# EAGLE design Board V.1C (EAGLE 7.2.0)
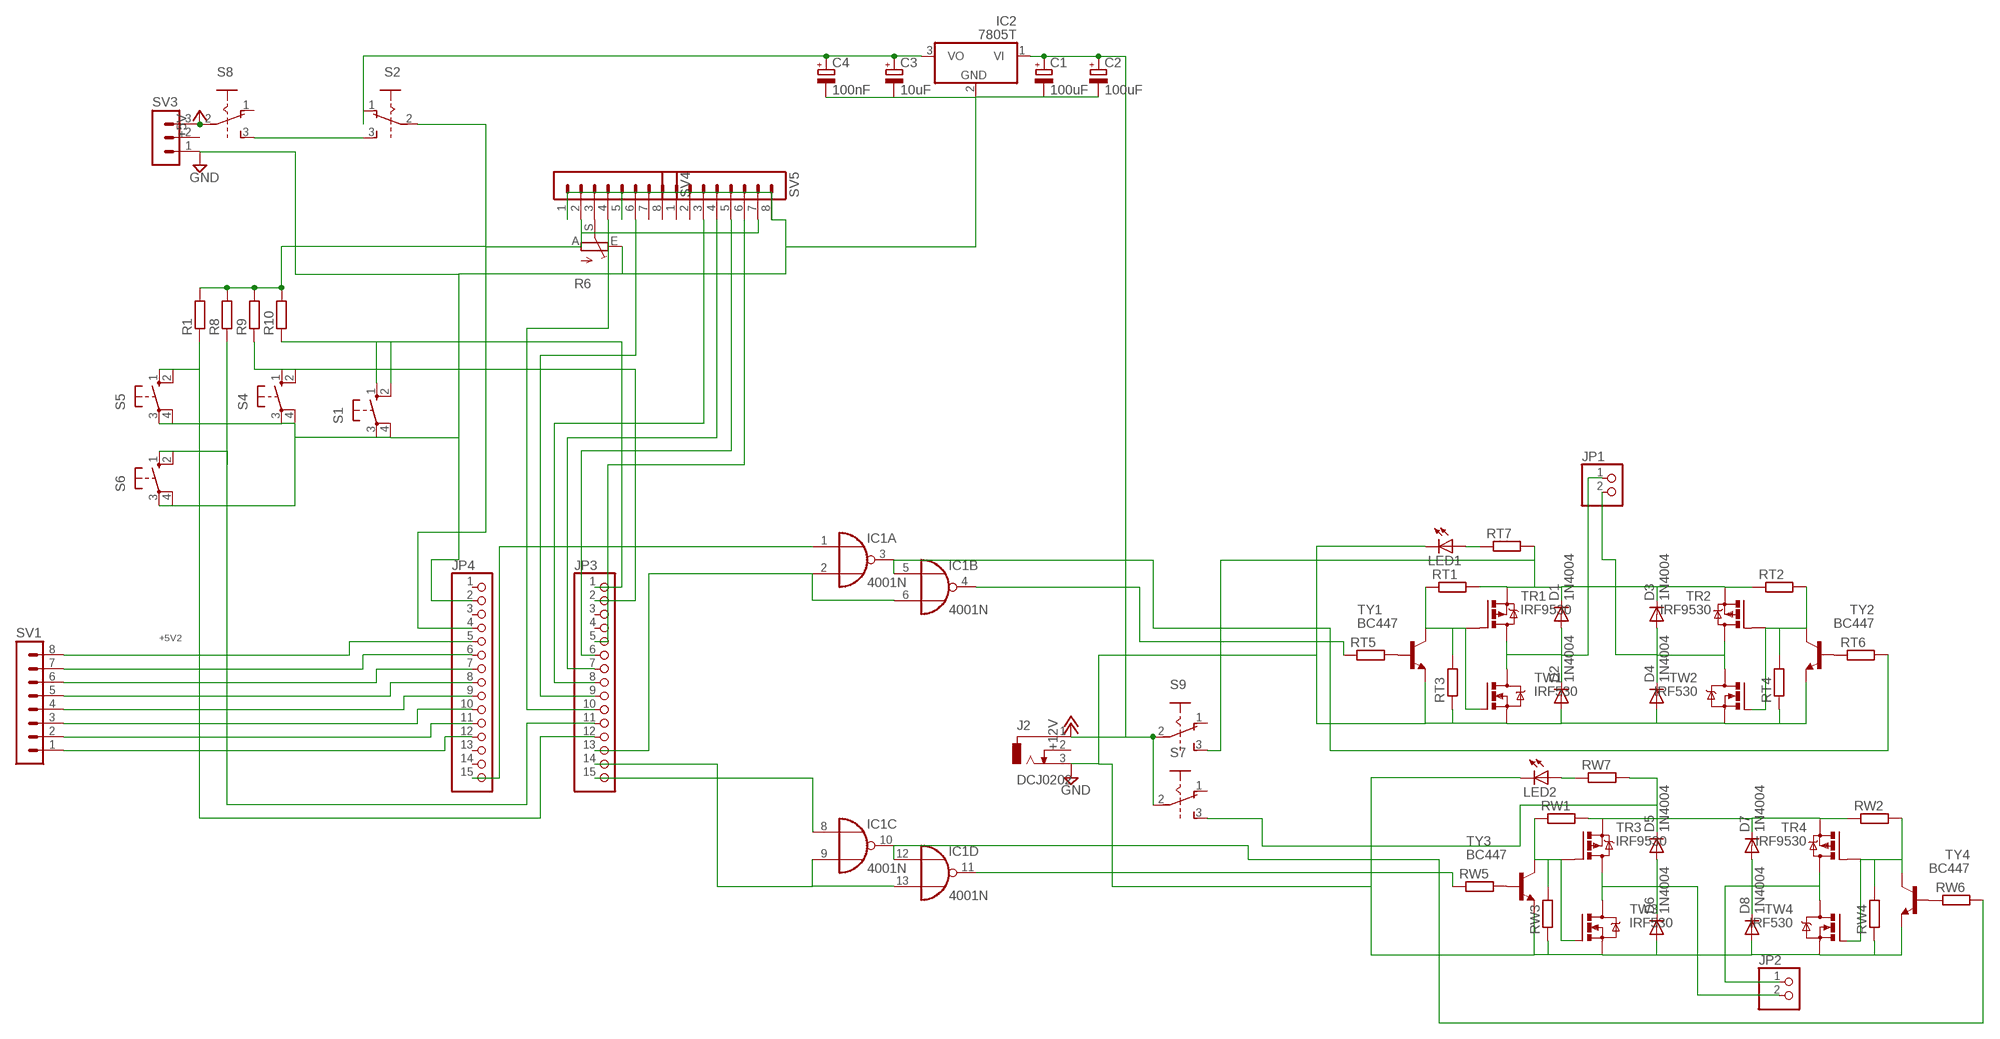
[diagram p0: schematic, sheet 1]

## Parts
C1  100uF  CPOL-EUE2.5-6  [E2,5-6]
C2  100uF  CPOL-EUE2.5-6  [E2,5-6]
C3  10uF  CPOL-EUE2.5-6  [E2,5-6]
C4  100nF  CPOL-EUE2.5-6  [E2,5-6]
D1  1N4004  [DO41-10]
D2  1N4004  [DO41-10]
D3  1N4004  [DO41-10]
D4  1N4004  [DO41-10]
D5  1N4004  [DO41-10]
D6  1N4004  [DO41-10]
D7  1N4004  [DO41-10]
D8  1N4004  [DO41-10]
IC1  4001N  [DIL14]
IC2  7805T  [TO220H]
J2  DCJ0202  [DCJ0202]
JP1  PINHD-1X2  [1X02]
JP2  PINHD-1X2  [1X02]
JP3  PINHD-1X15  [1X15]
JP4  PINHD-1X15  [1X15]
LED1  LED5MM  [LED5MM]
LED2  LED5MM  [LED5MM]
R1  R-EU_0204/7  [0204/7]
R6  TRIM_EU-B25P  [B25P]
R8  R-EU_0204/7  [0204/7]
R9  R-EU_0204/7  [0204/7]
R10  R-EU_0204/7  [0204/7]
RT1  R-EU_0207/7  [0207/7]
RT2  R-EU_0207/7  [0207/7]
RT3  R-EU_0207/7  [0207/7]
RT4  R-EU_0207/7  [0207/7]
RT5  R-EU_0207/7  [0207/7]
RT6  R-EU_0207/7  [0207/7]
RT7  R-EU_0207/7  [0207/7]
RW1  R-EU_0207/7  [0207/7]
RW2  R-EU_0207/7  [0207/7]
RW3  R-EU_0207/7  [0207/7]
RW4  R-EU_0207/7  [0207/7]
RW5  R-EU_0207/7  [0207/7]
RW6  R-EU_0207/7  [0207/7]
RW7  R-EU_0207/7  [0207/7]
S1  10-XX  [B3F-10XX]
S2  A68-A31  [A68-A31]
S4  10-XX  [B3F-10XX]
S5  10-XX  [B3F-10XX]
S6  10-XX  [B3F-10XX]
S7  A68-A31  [A68-A31]
S8  A68-A31  [A68-A31]
S9  A68-A31  [A68-A31]
SV1  MA08-1  [MA08-1]
SV3  MA03-1  [MA03-1]
SV4  MA08-1  [MA08-1]
SV5  MA08-1  [MA08-1]
TR1  IRF9530  [TO220BV]
TR2  IRF9530  [TO220BV]
TR3  IRF9530  [TO220BV]
TR4  IRF9530  [TO220BV]
TW1  IRF530  [TO220BV]
TW2  IRF530  [TO220BV]
TW3  IRF530  [TO220BV]
TW4  IRF530  [TO220BV]
TY1  BC447  [TO92-EBC]
TY2  BC447  [TO92-EBC]
TY3  BC447  [TO92-EBC]
TY4  BC447  [TO92-EBC]

## Nets
12V-A: D1.C D3.C RT1.2 RT2.1 RT7.2 S9.3(A:S) TR1.S TR2.S
12V-B: D5.C D7.C RW1.2 RW2.1 RW7.2 S7.3(A:S) TR3.S TR4.S
+5V: S8.2(A:P) SV3.3
+5V2: JP4.4 R1.2 R6.A R8.2 R9.2 R10.2 S2.2(A:P) SV4.2 SV5.7
+12V: C1.+ C2.+ IC2.1(VI) J2.1 S7.2(A:P) S9.2(A:P)
GND: C1.- C2.- C3.- C4.- D2.A D4.A D6.A D8.A IC2.2(GND) J2.3 JP4.2 LED1.K(C) LED2.K(C) R6.E RT3.1 RT4.1 RW3.1 RW4.1 S1.3(P) S1.4(P1) S4.3(P) S4.4(P1) S5.3(P) S5.4(P1) S6.3(P) S6.4(P1) SV3.1 SV4.1 SV4.5 SV5.8 TW1.S TW2.S TW3.S TW4.S TY1.E TY2.E TY3.E TY4.E
N$1: LED1.A RT7.1
N$2: LED2.A RW7.1
N$3: IC1.4(B:O) RT5.1
N$4: IC1.1(A:I0) JP4.15
N$5: S2.3(A:S) S8.3(A:S)
N$7: JP3.1 R10.1 S1.1(S) S1.2(S1)
N$8: C3.+ C4.+ IC2.3(VO)
N$9: RT1.1 RT3.2 TR1.G TW1.G TY1.C
N$10: JP4.8 SV1.5
N$11: JP3.10 SV4.4
N$12: IC1.8(C:I0) JP3.15
N$13: R6.S SV4.3
N$14: JP3.9 SV4.6
N$15: JP4.7 SV1.6
N$16: JP3.8 SV5.3
N$17: RT5.2 TY1.B
N$18: RT6.1 TY2.B
N$19: RT2.2 RT4.2 TR2.G TW2.G TY2.C
N$20: D7.A D8.C JP2.1 TR4.D TW4.D
N$21: D5.A D6.C JP2.2 TR3.D TW3.D
N$22: RW2.2 RW4.2 TR4.G TW4.G TY4.C
N$23: JP4.5 SV1.8
N$24: JP4.6 SV1.7
N$27: JP4.9 SV1.4
N$28: JP3.7 SV5.4
N$29: JP3.6 SV5.5
N$30: JP3.5 SV5.6
N$31: RW1.1 RW3.2 TR3.G TW3.G TY3.C
N$32: JP3.2 R9.1 S4.1(S) S4.2(S1)
N$33: JP3.11 R8.1 S6.1(S) S6.2(S1)
N$34: JP3.12 R1.1 S5.1(S) S5.2(S1)
N$35: RW6.1 TY4.B
N$38: RW5.2 TY3.B
N$40: IC1.2(A:I1) IC1.6(B:I1) JP3.13
N$43: JP4.12 SV1.1
N$45: IC1.9(C:I1) IC1.13(D:I1) JP3.14
N$46: JP4.10 SV1.3
N$47: JP4.11 SV1.2
N$51: D1.A D2.C JP1.1 TR1.D TW1.D
N$52: D3.A D4.C JP1.2 TR2.D TW2.D
N$53: IC1.3(A:O) IC1.5(B:I0) RT6.2
N$54: IC1.10(C:O) IC1.12(D:I0) RW6.2
N$55: IC1.11(D:O) RW5.1
Unconnected: J2.2 JP3.3 JP3.4 JP4.1 JP4.3 JP4.13 JP4.14 S2.1(A:O) S2.4(B:O) S2.5(B:P) S2.6(B:S) S7.1(A:O) S7.4(B:O) S7.5(B:P) S7.6(B:S) S8.1(A:O) S8.4(B:O) S8.5(B:P) S8.6(B:S) S9.1(A:O) S9.4(B:O) S9.5(B:P) S9.6(B:S) SV3.2 SV4.7 SV4.8 SV5.1 SV5.2

## Power pins joined to a net without a drawn wire
+5V: IC1.14(P:VDD)
GND: IC1.7(P:VSS)

## Library data of the parts
C1-C4 = resistor:CPOL-EU: POLARIZED CAPACITOR, European symbol
D1-D8 = diode:1N4004: DIODE general purpose rectifier, 1 A
IC1 = 40xx:4001: Quad 2-input NOR
IC2 = linear:78*: Positive VOLTAGE REGULATOR Source: http://cache.national.com/ds/LM/LM78L05.pdf http://www.fairchildsemi.com/ds/LM/LM7805.pdf
J2 = con-jack:DCJ0202: DC POWER JACK Source: DCJ0202.pdf
JP1 JP2 = pinhead:PINHD-1X2: PIN HEADER
JP3 JP4 = pinhead:PINHD-1X15: PIN HEADER
LED1 LED2 = led:LED: LED OSRAM: - CHIPLED LG R971, LG N971, LY N971, LG Q971, LY Q971, LO R971, LY R971 LH N974, LH R974 LS Q976, LO Q976, LY Q976 LO Q996 - Hyper CHIPLED LW Q18S LB Q993, LB Q99A, LB R99A - SideLED LS A670, LO A670, LY A670, LG A670, LP A670 LB A673, LV A673, LT A673, LW A673 LH A674 LY A675 LS A676, LA A676, LO A676, LY A676, LW A676 LS A679, LY A679, LG A679 - Hyper Micro SIDELED® LS Y876, LA Y876, LO Y876, LY Y876 LT Y87S - SmartLED LW L88C, LW L88S LB L89C, LB L89S, LG L890 LS L89K, LO L89K, LY L89K LS L896, LA L896, LO L896, LY L896 - TOPLED LS T670, LO T670, LY T670, LG T670, LP T670 LSG T670, LSP T670, LSY T670, LOP T670, LYG T670 LG T671, LOG T671, LSG T671 LB T673, LV T673, LT T673, LW T673 LH T674 LS T676, LA T676, LO T676, LY T676, LB T676, LH T676, LSB T676, LW T676 LB T67C, LV T67C, LT T67C, LS T67K, LO T67K, LY T67K, LW E67C LS E67B, LA E67B, LO E67B, LY E67B, LB E67C, LV E67C, LT E67C LW T67C LS T679, LY T679, LG T679 LS T770, LO T770, LY T770, LG T770, LP T770 LB T773, LV T773, LT T773, LW T773 LH T774 LS E675, LA E675, LY E675, LS T675 LS T776, LA T776, LO T776, LY T776, LB T776 LHGB T686 LT T68C, LB T68C - Hyper Mini TOPLED® LB M676 - Mini TOPLED Santana® LG M470 LS M47K, LO M47K, LY M47K Source: http://www.osram.convergy.de LUXEON: - LUMILED® LXK2-PW12-R00, LXK2-PW12-S00, LXK2-PW14-U00, LXK2-PW14-V00 LXK2-PM12-R00, LXK2-PM12-S00, LXK2-PM14-U00 LXK2-PE12-Q00, LXK2-PE12-R00, LXK2-PE12-S00, LXK2-PE14-T00, LXK2-PE14-U00 LXK2-PB12-K00, LXK2-PB12-L00, LXK2-PB12-M00, LXK2-PB14-N00, LXK2-PB14-P00, LXK2-PB14-Q00 LXK2-PR12-L00, LXK2-PR12-M00, LXK2-PR14-Q00, LXK2-PR14-R00 LXK2-PD12-Q00, LXK2-PD12-R00, LXK2-PD12-S00 LXK2-PH12-R00, LXK2-PH12-S00 LXK2-PL12-P00, LXK2-PL12-Q00, LXK2-PL12-R00 Source: www.luxeon.com KINGBRIGHT: KA-3528ASYC Source: www.kingbright.com
R1 R8-R10 RT1-RT7 RW1-RW7 = resistor:R-EU_: RESISTOR, European symbol
R6 = pot:TRIM_EU-: POTENTIOMETER
S1 S4-S6 = switch-omron:10-XX: OMRON SWITCH
S2 S7-S9 = switch:A68-A31: SLIDING SWITCH Siemens, distributor Buerklin, 11G766
SV1 SV4 SV5 = con-lstb:MA08-1: PIN HEADER; OC_FARNELL: unknown; OC_NEWARK: unknown
SV3 = con-lstb:MA03-1: PIN HEADER
TR1-TR4 = transistor-power:IRF9530: P-CHANNEL HEXFET POWER-MOS-FET Source: http://www.irf.com/product-info/datasheets/data/irf9530.pdf
TW1-TW4 = transistor-power:IRF530: HEXFET Power MOSFET
TY1-TY4 = transistor-npn:BC447*: NPN Transistor

## Net classes
0 default: width 0.051 mm, clearance 0.051 mm

## Board
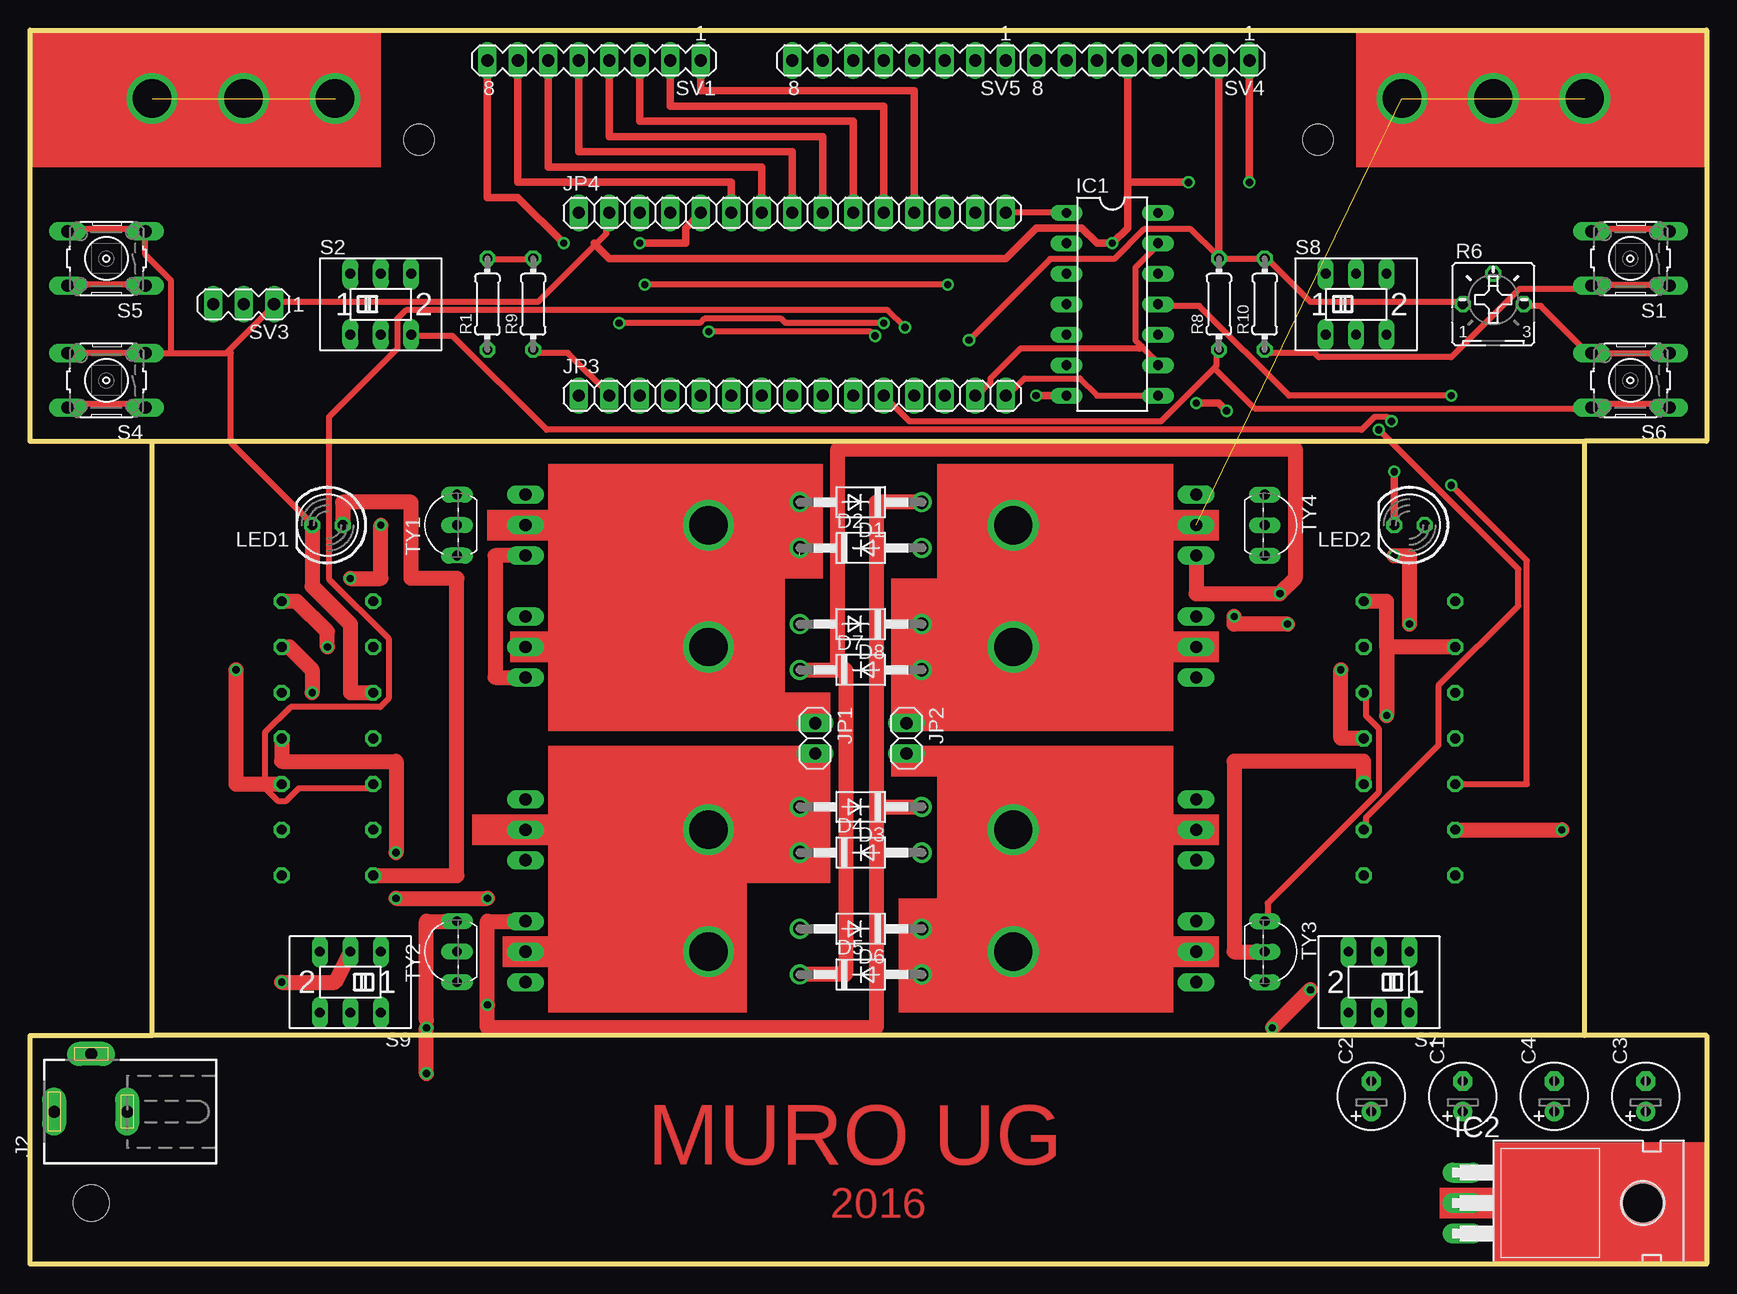
[diagram p1: board, top side]
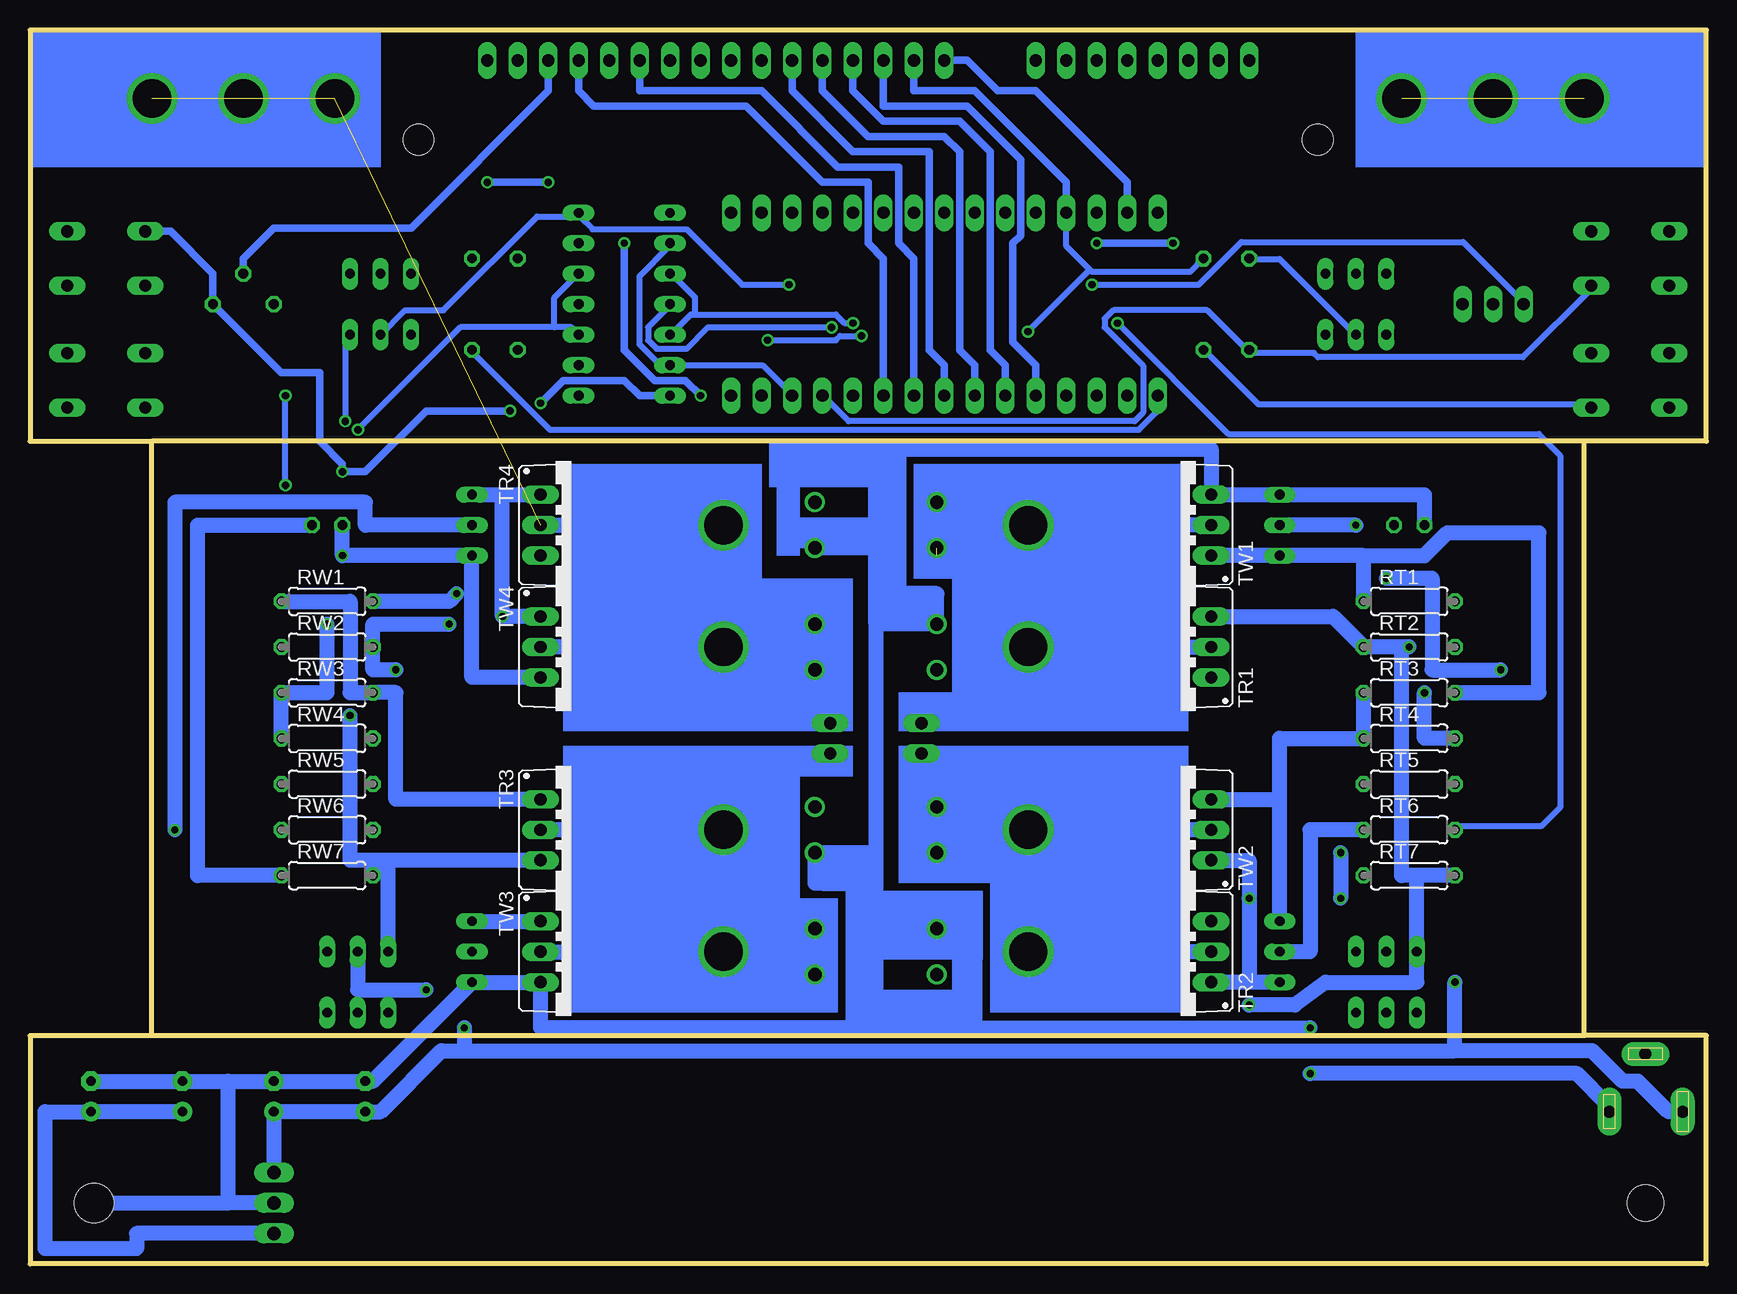
[diagram p2: board, bottom side, seen from below]

Size 139.7 x 102.87 mm. Coordinates in mm from the lower left corner, seen from the top.
Outline: 129.54,19.05 139.7,19.05 139.7,0 0,0 0,19.05 10.16,19.05
Outline: 10.16,19.05 10.16,68.58
Outline: 129.54,19.05 129.54,68.58
Outline: 10.16,68.58 0,68.58 0,102.87 139.7,102.87 139.7,68.58 129.54,68.58
Outline: 10.16,68.58 129.54,68.58
Outline: 129.54,19.05 10.16,19.05
Copper layers (1*16): Top 0.035mm / dielectric 1.5mm / Bottom 0.035mm
Design rules "default *": minimum track width 20mil, minimum drill 24mil, track to track 8mil, track to pad 8mil, pad to pad 8mil, via to via 8mil, smd to smd 8mil, copper to edge 40mil, drill to drill 8mil, minimum pad ring 10mil, minimum via ring 8mil, stop-mask expansion 4mil, vias tented up to drill 0mil, thermal gap 10mil
Holes 3 mm at 5.08,5.08
Holes 2.54 mm at 32.38,93.73 107.31,93.73

### Footprints (pad centres in the part's own frame; a part is rotated, then mirrored left to right if it is on the bottom)
E2,5-6 = drill 0.813 pad 1.6: + -1.27,0 | drill 0.813 pad 1.6 octagon: - 1.27,0
DO41-10 = drill 1.118: A 5.08,0; C -5.08,0
DIL14 = drill 0.813 long: 1 -7.62,-3.81; 2 -5.08,-3.81; 3 -2.54,-3.81; 4 0,-3.81; 5 2.54,-3.81; 6 5.08,-3.81; 7 7.62,-3.81; 8 7.62,3.81; 9 5.08,3.81; 10 2.54,3.81; 11 0,3.81; 12 -2.54,3.81; 13 -5.08,3.81; 14 -7.62,3.81
TO220H = drill 1.118 long: 1 -2.54,-10.16; 2 0,-10.16; 3 2.54,-10.16 | hole 3.302: 0,4.826
DCJ0202 = drill 1 pad 2 long: 1 0,3.1; 2 4.8,0; 3 0,-3
1X02 = drill 1.016 long: 1 -1.27,0; 2 1.27,0
1X15 = drill 1.016 long: 1 -17.78,0; 2 -15.24,0; 3 -12.7,0; 4 -10.16,0; 5 -7.62,0; 6 -5.08,0; 7 -2.54,0; 8 0,0; 9 2.54,0; 10 5.08,0; 11 7.62,0; 12 10.16,0; 13 12.7,0; 14 15.24,0; 15 17.78,0
LED5MM = drill 0.813 octagon: A -1.27,0; K 1.27,0
0204/7 = drill 0.813 octagon: 1 -3.81,0; 2 3.81,0
B25P = drill 0.813 octagon: A -2.54,0; E 2.54,0; S 0,2.54
0207/7 = drill 0.813 octagon: 1 -3.81,0; 2 3.81,0
B3F-10XX = drill 1.016 long: 1 -3.251,2.261; 2 3.251,2.261; 3 -3.251,-2.261; 4 3.251,-2.261
A68-A31 = drill 0.813 long: 1 -2.54,-2.54; 2 0,-2.54; 3 2.54,-2.54; 4 -2.54,2.54; 5 0,2.54; 6 2.54,2.54
MA08-1 = drill 1.016 long: 1 -8.89,0; 2 -6.35,0; 3 -3.81,0; 4 -1.27,0; 5 1.27,0; 6 3.81,0; 7 6.35,0; 8 8.89,0
MA03-1 = drill 1.016 long: 1 -2.54,0; 2 0,0; 3 2.54,0
TO220BV = drill 1.016 long: D 0,-2.54; G -2.54,-2.54; S 2.54,-2.54
TO92-EBC = drill 0.813 long: B 0,-1.27; C -2.54,-1.27; E 2.54,-1.27

### Placement (x,y rotation side)
C1  119.38,13.97 90 top
C2  111.76,13.97 90 top
C3  134.62,13.97 90 top
C4  127,13.97 90 top
D1  69.22,63.5 180 top
D2  69.22,59.69 0 top
D3  69.22,38.1 180 top
D4  69.22,34.29 0 top
D5  69.22,24.13 0 top
D6  69.22,27.94 180 top
D7  69.22,49.53 0 top
D8  69.22,53.34 180 top
IC1  90.17,80.01 270 top
IC2  129.54,5.08 270 top
J2  5.08,12.7 90 top
JP1  65.41,43.82 270 top
JP2  73.03,43.82 270 top
JP3  63.5,72.39 0 top
JP4  63.5,87.63 0 top
LED1  24.77,61.6 180 top
LED2  114.94,61.6 180 top
R1  38.1,80.01 90 top
R6  121.92,80.01 0 top
R8  99.06,80.01 90 top
R9  41.91,80.01 90 top
R10  102.87,80.01 90 top
RT1  24.77,55.24 0 bottom
RT2  24.77,51.43 0 bottom
RT3  24.77,47.63 0 bottom
RT4  24.77,43.82 0 bottom
RT5  24.77,40.01 0 bottom
RT6  24.77,36.2 0 bottom
RT7  24.77,32.38 0 bottom
RW1  114.94,55.24 0 bottom
RW2  114.94,51.43 0 bottom
RW3  114.94,47.63 0 bottom
RW4  114.94,43.82 0 bottom
RW5  114.94,40.01 0 bottom
RW6  114.94,36.2 0 bottom
RW7  114.94,32.38 0 bottom
S1  133.35,83.82 180 top
S2  29.21,80.01 0 top
S4  6.35,73.66 180 top
S5  6.35,83.82 180 top
S6  133.35,73.66 180 top
S7  112.39,23.5 180 top
S8  110.49,80.01 0 top
S9  26.67,23.5 180 top
SV1  46.99,100.33 180 top
SV3  17.78,80.01 180 top
SV4  92.71,100.33 180 top
SV5  72.39,100.33 180 top
TR1  43.81,51.43 90 bottom
TR2  43.81,26.04 90 bottom
TR3  94.61,36.2 270 bottom
TR4  94.61,61.6 270 bottom
TW1  43.81,61.6 90 bottom
TW2  43.81,36.2 90 bottom
TW3  94.61,26.04 270 bottom
TW4  94.61,51.43 270 bottom
TY1  34.29,61.6 90 top
TY2  34.29,26.04 90 top
TY3  104.14,26.04 270 top
TY4  104.14,61.6 270 top

### Tracks (layer width: path | path; a pad name or v marks a point on that pad's centre or on a via)
12V-A  (via drill 0.6)
  Top 1.27: 40.01,28.58 TR2.S 38.1,28.58 v38.1,21.59 38.1,19.69 70.48,19.69 70.48,38.1 | D1.C 70.48,63.5 70.48,38.1 | 70.48,38.1 D3.C | v24.77,51.43 24.77,52.71 22.23,55.24 RT1.2
  Bottom 1.27: TR1.S 31.11,53.98 RT2.1 25.4,51.43 | v24.77,51.43 25.4,51.43 | v38.1,21.59 34.29,21.59 31.75,23.5 24.13,23.5 S9.3 24.13,32.38 | RT7.2 24.13,32.38 | 24.13,32.38 25.4,32.38 25.4,51.43
12V-B  (via drill 0.6)
  Top 1.27: RW2.1 113.03,51.43 | 113.03,51.43 113.03,55.24 RW1.2 | TR4.S 97.16,55.88 v104.14,55.88 105.41,57.15 105.41,67.94 67.31,67.94 67.31,49.53 | 113.03,51.43 v113.03,45.72 | D7.C 67.31,49.53 | D5.C 67.94,24.13 67.94,49.53 67.31,49.53
  Bottom 1.27: TR3.S 109.86,33.66 | 109.86,33.66 111.12,33.66 | 111.12,33.66 RW7.2 | v104.14,55.88 104.78,55.24 RW1.2 | 111.12,33.66 113.03,33.66 v113.03,45.72 | S7.3 109.86,33.66
+5V  (via drill 0.61)
  Top 0.508: v76.45,81.64 v51.21,81.64
  Bottom 0.508: S8.2 108.46,79.5 105.26,79.5 97.43,87.32 94.23,87.32 IC1.14 93.88,87.32 92.81,86.26 84.99,86.26 80.37,81.64 v76.45,81.64 | v51.21,81.64 42.32,81.64 38.76,85.19 20.27,85.19 15.29,80.21 SV3.3
+5V2  (via drill 0.61)
  Top 0.508: R9.2 41.6,83.77 38.41,83.77 R1.2 | R6.A 119.13,80.21 106.68,80.21 103.12,83.77 R10.2 102.77,83.77 99.21,83.77 R8.2 98.86,84.12 96.72,86.26 92.81,86.26 90.32,83.77 84.99,83.77 v78.23,77.01 | v56.54,77.72 70.05,77.72 v70.41,77.37
  Top 0.61: SV4.2 R8.2
  Bottom 0.508: S2.2 29.52,77.72 35.56,83.77 38.05,83.77 R1.2 | JP4.4 53.34,84.84 51.38,82.88 | 51.38,82.88 51.21,82.7 43.03,82.7 R9.2 | v56.54,77.72 51.38,82.88 | v70.41,77.37 72.19,77.37 72.54,77.01 v78.23,77.01
  Bottom 0.61: SV5.7 66.04,97.79 60.96,97.79 53.34,90.17 JP4.4
+12V  (via drill 0.6)
  Top 1.27: v20.95,23.5 25.4,23.5 S9.2 | v106.68,22.86 v103.5,19.69
  Bottom 1.27: J2.1 3.17,12.7 5.71,15.24 6.99,15.24 9.53,17.78 20.95,17.78 | 20.95,17.78 v20.95,23.5 | 103.5,17.78 105.41,17.78 110.49,12.7 C2.+ C1.+ IC2.1 | 103.5,17.78 20.95,17.78 | S7.2 112.39,22.86 v106.68,22.86 | v103.5,19.69 103.5,17.78
GND  (via drill 0.6)
  Top 0.508: S5.4 3.2,86.26 9.6,86.26 S5.3 9.6,84.12 11.73,81.99 11.73,75.95 | 9.6,75.95 3.2,75.95 S4.4 | 16.54,76.12 16.36,75.95 11.73,75.95 | 16.54,76.12 20.27,79.86 SV3.1 20.62,80.21 42.32,80.21 47.09,84.99 48.01,85.9 48.01,87.32 JP4.2 | 9.6,75.95 11.73,75.95 | 9.6,75.95 S4.3 | S1.4 130.15,86.26 136.55,86.26 S1.3 | R6.E 124.46,79.86 125.88,79.86 129.79,75.95 S6.4 130.15,75.95 136.55,75.95 S6.3 | 16.54,76.12 16.71,75.95 16.71,68.48 23.11,62.08 LED1.K
  Top 0.61: LED2.K v113.67,66.04 | v97.16,71.75 99.06,71.75 v99.69,71.12 | SV4.5 91.44,90.17 | 91.44,90.17 v96.52,90.17 | v101.6,90.17 SV4.1 | v83.82,72.39 IC1.7 | 91.44,90.17 91.44,86.36 v90.17,85.09 88.9,85.09 87.63,86.36 83.82,86.36 81.28,83.82 48.26,83.82 47.09,84.99 46.99,85.09
  Top 1.27: v113.67,59.05 114.94,59.05 v114.94,53.34 | 33.02,20.32 33.02,28.58 TY2.E | v33.02,15.88 v33.02,19.69 | LED1.K 23.5,56.52 26.67,53.34 26.67,47.63 RT3.1
  Bottom 0.61: S1.4 127.99,86.08 124.46,82.55 R6.E 118.75,74.29 115.57,74.29 115.57,68.58 113.67,66.68 v113.67,66.04 111.76,66.04 106.68,71.12 v99.69,71.12 | IC1.7 88.9,72.39 90.17,73.66 95.25,73.66 v97.16,71.75 | JP4.2 48.26,90.17 55.88,97.79 59.05,97.79 61.59,100.33 SV5.8 | v96.52,90.17 v101.6,90.17 | v83.82,72.39 85.09,73.66 87.63,73.66 90.17,76.2 v90.17,85.09
  Bottom 1.27: TY2.E 35.56,38.74 | TW2.S 35.56,38.74 | 35.56,38.74 35.56,43.82 RT4.1 RT3.1 | TW4.S 102.87,48.9 TY4.E v113.67,59.05 LED2.K | LED1.K 23.5,64.13 TY1.E TW1.S 41.27,67.94 67.31,67.94 67.31,55.88 64.14,55.88 D8.A 69.22,53.34 | 69.22,53.34 69.22,59.69 D2.A | 69.22,53.34 69.22,34.29 | 69.22,34.29 D4.A 74.3,31.75 71.12,31.75 71.12,19.69 97.16,19.69 TW3.S TY3.E 111.12,15.24 C2.- C1.- 123.19,15.24 | 69.22,34.29 69.22,27.94 D6.A 60.96,27.94 60.96,19.69 v33.02,19.69 | RW4.1 RW3.1 114.94,47.63 v114.94,53.34 | C3.- C4.- 123.19,15.24 | J2.3 8.08,13.16 10.79,15.88 v33.02,15.88 | IC2.2 123.19,5.08 | 134.62,5.08 123.19,5.08 | 123.19,5.08 123.19,15.24
N$1
  Top 1.27: RT7.1 35.56,32.38 35.56,57.15 31.75,57.15 31.75,63.5 26.04,63.5 LED1.A
N$2
  Bottom 1.27: RW7.1 125.73,32.38 125.73,61.6 LED2.A
N$3  (via drill 0.61)
  Top 0.508: v72.9,78.08 71.48,79.5 31.29,79.5 30.58,78.79 30.58,76.3 24.89,70.61 24.89,57.1 29.87,52.12 29.87,47.14 29.16,46.43 21.69,46.43 19.56,44.3 19.56,39.68 20.62,38.61 21.34,38.61 22.4,39.68 28.45,39.68 RT5.1
  Bottom 0.508: v72.9,78.08 83.21,78.08 84.99,76.3 87.48,76.3 88.19,77.01 88.19,78.08 86.41,79.86 IC1.4
N$4
  Top 0.508: IC1.1 86.06,87.68 81.43,87.68 JP4.15
N$5  (via drill 0.61)
  Top 0.508: v113.44,70.26 113.08,70.61 112.01,70.61 110.95,69.54 43.03,69.54 35.2,77.37 32,77.37 S2.3
  Bottom 0.508: v113.44,70.26 113.44,77.01 113.08,77.37 S8.3
N$6  (via drill 3.2)  (2 unrouted)
  other vias: 10.16,97.16 17.78,97.16 25.4,97.16
N$7
  Top 0.508: R10.1 103.12,75.95 107.04,75.95 107.39,75.59 118.42,75.59 124.1,81.28 129.79,81.28 S1.2 130.15,81.64 136.55,81.64 S1.1
  Bottom 0.508: JP3.1 45.87,72.39 45.87,70.97 47.3,69.54 96.37,69.54 102.77,75.95 R10.1
N$8
  Bottom 1.27: C4.+ C3.+ 138.43,12.7 138.43,1.27 130.81,1.27 130.81,2.54 IC2.3
N$9
  Top 1.27: TW1.G 38.73,59.05 38.73,48.9 TR1.G
  Bottom 1.27: TW1.G TY1.C 28.57,59.05 | RT1.1 28.57,59.05 | RT3.2 13.97,47.63 13.97,60.96 21.59,60.96 23.5,59.05 28.57,59.05
N$10
  Top 0.61: SV1.5 45.72,92.71 63.5,92.71 JP4.8
N$11
  Bottom 0.61: JP3.10 68.58,83.82 69.85,85.09 69.85,90.17 73.66,90.17 80.01,96.52 92.71,96.52 93.98,97.79 SV4.4
N$12
  Top 0.508: IC1.8 88.9,72.39 87.48,73.81 82.86,73.81 81.43,72.39 JP3.15
N$13
  Bottom 0.61: SV4.3 96.52,97.79 107.95,86.36 119.38,86.36 121.92,83.82 R6.S
N$14
  Bottom 0.61: JP3.9 66.04,83.82 67.31,85.09 67.31,91.44 72.39,91.44 78.74,97.79 88.9,97.79 SV4.6
N$15
  Top 0.61: SV1.6 43.18,91.44 60.96,91.44 JP4.7
N$16
  Bottom 0.61: JP3.8 63.5,74.93 64.77,76.2 64.77,92.71 71.12,92.71 76.2,97.79 SV5.3
N$17  (via drill 0.6)
  Top 1.27: v26.67,57.15 29.21,57.15 v29.21,61.6 | v17.14,49.53 17.14,40.01 RT5.2
  Bottom 1.27: v26.67,57.15 22.86,57.15 22.86,49.53 v17.14,49.53 | v29.21,61.6 TY1.B
N$18
  Bottom 1.27: RT6.1 33.02,36.2 33.02,26.04 TY2.B
N$19  (via drill 0.6)
  Top 1.27: RT4.2 20.95,41.91 30.48,41.91 v30.48,34.29 | v30.48,30.48 v38.1,30.48 | RT2.2 21.59,51.43 23.5,49.53 v23.5,47.63
  Bottom 1.27: TY2.C 38.1,23.5 | 38.1,23.5 TR2.G | TW2.G 38.1,33.66 v38.1,30.48 38.1,23.5 | v30.48,34.29 v30.48,30.48 | RT4.2 23.5,43.82 v23.5,47.63
N$20  (via drill 3.2)  (3 unrouted)
  Bottom 1.27: TR4.D v81.92,61.6 81.92,53.34 | 81.92,53.34 v81.92,51.43 TW4.D | 81.92,53.34 D8.C D7.A 74.3,45.09 JP2.1
  other vias: 114.3,97.16 121.92,97.16 129.54,97.16
N$21  (via drill 3.2)
  Bottom 1.27: D5.A D6.C 81.92,27.94 v81.92,26.04 | v81.92,26.04 v81.92,36.2 | v81.92,36.2 TR3.D | TW3.D v81.92,26.04 | JP2.2 81.92,42.54 v81.92,36.2
N$22  (via drill 0.6)
  Top 1.27: RW4.2 109.22,43.82 v109.22,49.53 | v104.78,53.34 100.33,53.34 v100.33,53.98
  Bottom 1.27: TY4.C 100.33,64.13 | 100.33,64.13 TR4.G | TW4.G v100.33,53.98 100.33,64.13 | v109.22,49.53 111.12,49.53 RW2.2 111.12,53.34 v104.78,53.34
N$23  (via drill 0.6)
  Top 0.61: SV1.8 38.1,88.9 40.64,88.9 v44.45,85.09 | v50.8,85.09 54.61,85.09 54.61,86.36 JP4.5
  Bottom 0.61: v44.45,85.09 v50.8,85.09
N$24
  Top 0.61: SV1.7 40.64,90.17 58.42,90.17 JP4.6
N$27
  Top 0.61: SV1.4 48.26,93.98 66.04,93.98 JP4.9
N$28
  Bottom 0.61: SV5.4 73.66,97.79 69.85,93.98 63.5,93.98 62.23,92.71 62.23,76.2 60.96,74.93 JP3.7
N$29
  Bottom 0.61: JP3.6 58.42,74.93 59.69,76.2 59.69,92.71 62.23,95.25 68.58,95.25 71.12,97.79 SV5.5
N$30
  Bottom 0.61: JP3.5 55.88,74.93 57.78,76.84 57.78,85.09 57.15,85.72 57.15,92.07 61.59,96.52 68.58,96.52 SV5.6
N$31
  Top 0.508: TY3.C 103.12,28.65 103.12,30.07 112.37,39.32 112.37,44.65 111.3,45.72 111.3,47.5 RW3.2
  Bottom 1.27: TY3.C TW3.G | TR3.G 109.22,38.74 109.22,47.63 RW3.2 113.03,47.63 113.03,55.24 RW1.1
N$32
  Top 0.508: S4.2 3.2,71.68 9.6,71.68 S4.1 | R9.1 41.96,75.95 44.81,75.95 48.36,72.39 JP3.2
  Bottom 0.508: S4.1 9.6,71.68 37.34,71.68 41.6,75.95 R9.1
N$33
  Top 0.508: S6.1 136.55,71.68 130.15,71.68 S6.2 129.79,71.32 102.06,71.32 98.68,74.7 | 98.68,74.7 94.23,70.26 73.25,70.26 JP3.11 | 98.68,74.7 98.86,74.88 98.86,75.95 R8.1
N$34
  Top 0.508: S5.2 3.2,81.64 9.6,81.64 S5.1
  Bottom 0.508: S5.1 9.6,81.28 15.29,75.59 32.36,75.59 32.72,75.95 38.05,75.95 R1.1 38.41,76.3 41.6,79.5 49.43,79.5 50.14,78.79 50.14,78.08 46.94,74.88 46.94,70.97 47.65,70.26 71.48,70.26 73.61,72.39 JP3.12
N$35  (via drill 0.6)
  Top 1.27: RW6.1 v127.64,36.2
  Bottom 1.27: TY4.B 111.76,61.6 111.76,63.5 127.64,63.5 v127.64,36.2
N$38
  Top 1.27: TY3.B 100.33,26.04 100.33,41.91 111.12,41.91 RW5.2
N$40
  Bottom 0.508: JP3.13 76.1,72.39 78.59,74.88 86.06,74.88 IC1.6 86.41,75.24 87.48,75.24 88.9,76.66 88.9,82.35 86.41,84.84 IC1.2
N$43
  Top 0.61: SV1.1 55.88,97.79 73.66,97.79 JP4.12
N$45
  Top 0.508: 92.63,76.48 92.1,77.01 92.1,83.06 93.88,84.84 IC1.13 | 92.63,76.48 93.88,75.24 IC1.9 | JP3.14 78.94,72.39 80.01,73.46 80.01,73.81 82.5,76.3 92.46,76.3 92.63,76.48
N$46
  Top 0.61: SV1.3 50.8,95.25 68.58,95.25 JP4.10
N$47
  Top 0.61: SV1.2 53.34,96.52 71.12,96.52 JP4.11
N$51  (via drill 3.2)  (1 unrouted)
  Bottom 1.27: TW1.D v56.52,61.6 | v56.52,51.43 TR1.D | v56.52,61.6 v56.52,51.43 | v56.52,61.6 56.52,63.5 D1.A 64.14,59.05 | JP1.1 56.52,45.09 v56.52,51.43
N$52  (via drill 3.2)
  Bottom 1.27: TW2.D v56.52,36.2 | v56.52,36.2 v56.52,26.04 TR2.D | D4.C D3.A | D3.A 56.52,38.1 v56.52,36.2 | JP1.2 64.14,42.54 D3.A
N$53  (via drill 0.61)
  Top 0.508: v49.07,78.44 55.83,78.44 56.19,78.79 62.59,78.79 62.94,78.44 v71.12,78.44
  Bottom 0.508: v49.07,78.44 39.83,69.19 13.97,69.19 12.19,67.41 12.19,38.05 13.77,36.47 20.62,36.47 RT6.2 | v71.12,78.44 71.83,78.44 72.54,79.15 84.28,79.15 | 84.28,79.15 84.63,79.15 86.06,77.72 IC1.5 | 84.28,79.15 84.28,80.57 86.06,82.35 IC1.3
N$54  (via drill 0.61)
  Top 0.508: v112.37,69.54 124,57.91 124,54.86 117.35,48.21 117.35,43.23 111.3,37.19 111.3,36.47 RW6.2
  Bottom 0.508: v112.37,69.54 103.83,78.08 96.01,78.08 | 96.01,78.08 94.59,78.08 IC1.10 | 96.01,78.08 96.01,80.57 94.23,82.35 IC1.12
N$55  (via drill 0.61)
  Top 0.508: v118.42,72.39 104.9,72.39 97.43,79.86 94.23,79.86 IC1.11 | v118.42,64.92 124.71,58.62 124.71,40.01 RW5.1
  Bottom 0.508: v118.42,64.92 v118.42,72.39
(copper drawn outside any net)
  shapes: Bottom area x24, Top area x22

### Text on the board
Top: MURO UG | 2016